# EAGLE design FEZ Cerb40 (EAGLE 5.04)
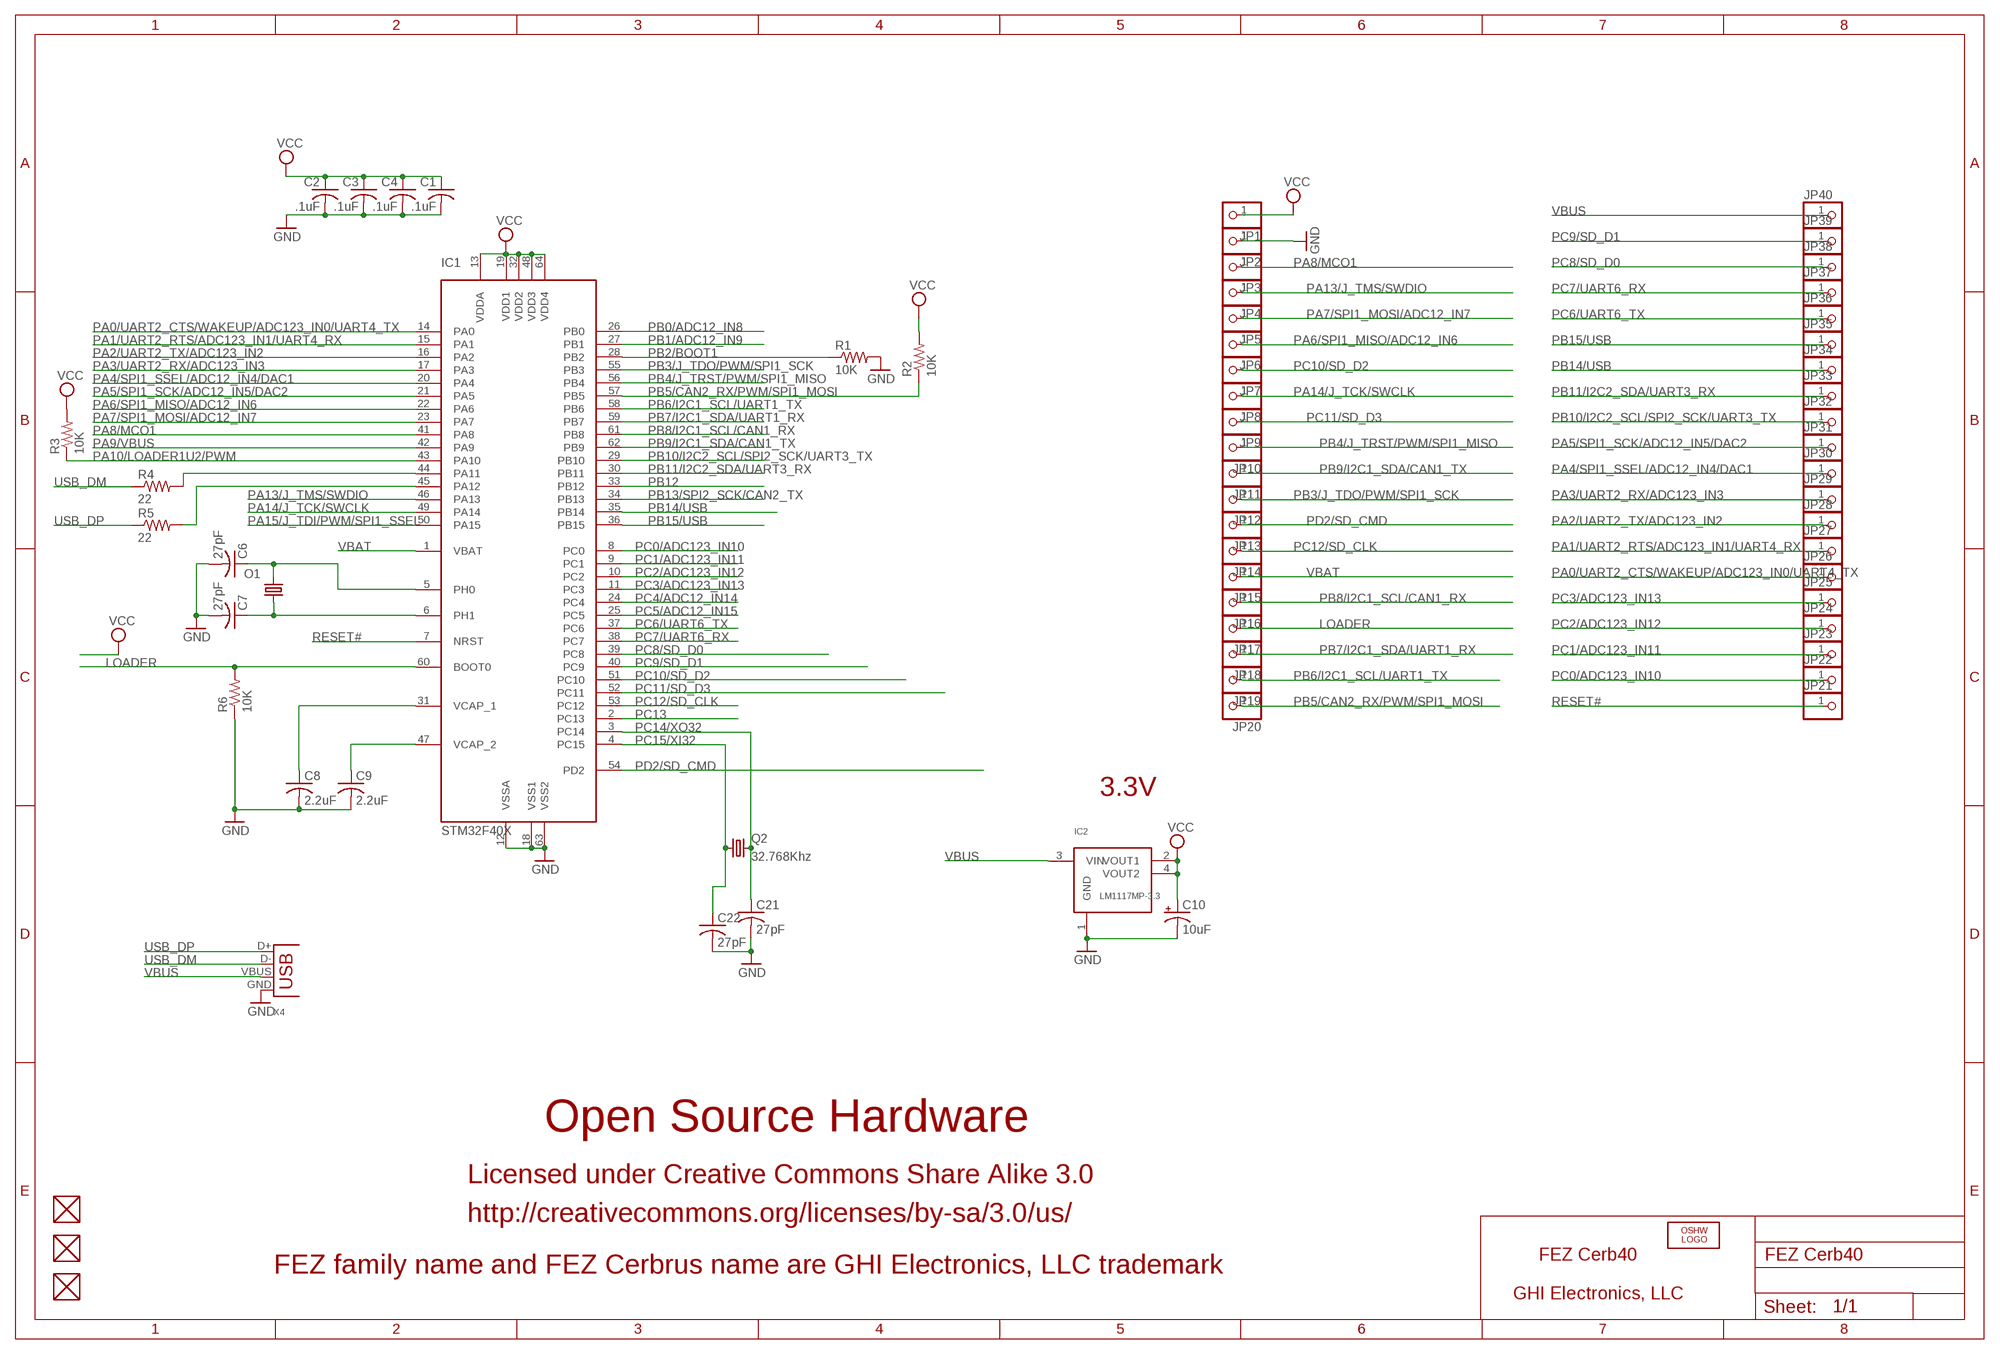
[diagram p0: schematic, sheet 1]

## Parts
C1  .1uF  C-USC0603K  [C0603K]
C2  .1uF  C-USC0603K  [C0603K]
C3  .1uF  C-USC0603K  [C0603K]
C4  .1uF  C-USC0603K  [C0603K]
C6  27pF  C-USC0603K  [C0603K]
C7  27pF  C-USC0603K  [C0603K]
C8  2.2uF  C-USC0805K  [C0805K]
C9  2.2uF  C-USC0805K  [C0805K]
C10  10uF  CPOL-USCT3528  [CT3528]
C21  27pF  C-USC0603K  [C0603K]
C22  27pF  C-USC0603K  [C0603K]
FUD1  FIDUCIAL  [FIDUCIAL_40MIL]
FUD2  FIDUCIAL  [FIDUCIAL_40MIL]
FUD3  FIDUCIAL  [FIDUCIAL_40MIL]
IC1  STM32F40X  [LQFP64]
IC2  LM1117MP-3.3  LM1117  [SOT223]
JP1  PINHD-1X1  [1X01]
JP2  PINHD-1X1  [1X01]
JP3  PINHD-1X1  [1X01]
JP4  PINHD-1X1  [1X01]
JP5  PINHD-1X1  [1X01]
JP6  PINHD-1X1  [1X01]
JP7  PINHD-1X1  [1X01]
JP8  PINHD-1X1  [1X01]
JP9  PINHD-1X1  [1X01]
JP10  PINHD-1X1  [1X01]
JP11  PINHD-1X1  [1X01]
JP12  PINHD-1X1  [1X01]
JP13  PINHD-1X1  [1X01]
JP14  PINHD-1X1  [1X01]
JP15  PINHD-1X1  [1X01]
JP16  PINHD-1X1  [1X01]
JP17  PINHD-1X1  [1X01]
JP18  PINHD-1X1  [1X01]
JP19  PINHD-1X1  [1X01]
JP20  PINHD-1X1  [1X01]
JP21  PINHD-1X1  [1X01]
JP22  PINHD-1X1  [1X01]
JP23  PINHD-1X1  [1X01]
JP24  PINHD-1X1  [1X01]
JP25  PINHD-1X1  [1X01]
JP26  PINHD-1X1  [1X01]
JP27  PINHD-1X1  [1X01]
JP28  PINHD-1X1  [1X01]
JP29  PINHD-1X1  [1X01]
JP30  PINHD-1X1  [1X01]
JP31  PINHD-1X1  [1X01]
JP32  PINHD-1X1  [1X01]
JP33  PINHD-1X1  [1X01]
JP34  PINHD-1X1  [1X01]
JP35  PINHD-1X1  [1X01]
JP36  PINHD-1X1  [1X01]
JP37  PINHD-1X1  [1X01]
JP38  PINHD-1X1  [1X01]
JP39  PINHD-1X1  [1X01]
JP40  PINHD-1X1  [1X01]
LOGO1  LOGO-OSHW-FILLX0200-NT  [OSHW_FILLX200_NOTEXT]
O1  12Mhz  CRYTALSM49  [SM49@1]
Q2  32.768Khz  CRYSTALTC38H  [TC38H]
R1  10K  R-US_R0603  [R0603]
R2  10K  R-US_R0603  [R0603]
R3  10K  R-US_R0603  [R0603]
R4  22  R-US_R0603  [R0603]
R5  22  R-US_R0603  [R0603]
R6  10K  R-US_R0603  [R0603]
X4  DX2R005HN2E700  USB-MB-S  [USB-MB-S]

## Nets
GND [power]: C1.2 C2.2 C3.2 C4.2 C6.2 C7.2 C8.2 C9.2 C10.- C21.2 C22.2 IC1.12(VSSA) IC1.18(VSS1) IC1.63(VSS2) IC2.1(GND) JP2.1 R1.2 R6.1 X4.GND
LOADER: IC1.60(BOOT0) JP17.1 R6.2
N$2: C9.1 IC1.47(VCAP_2)
N$3: C8.1 IC1.31(VCAP_1)
N$5: IC1.44(PA11) R4.2
N$7: IC1.45(PA12) R5.2
PA0/UART2_CTS/WAKEUP/ADC123_IN0/UART4_TX: IC1.14(PA0) JP26.1
PA1/UART2_RTS/ADC123_IN1/UART4_RX: IC1.15(PA1) JP27.1
PA2/UART2_TX/ADC123_IN2: IC1.16(PA2) JP28.1
PA3/UART2_RX/ADC123_IN3: IC1.17(PA3) JP29.1
PA4/SPI1_SSEL/ADC12_IN4/DAC1: IC1.20(PA4) JP30.1
PA5/SPI1_SCK/ADC12_IN5/DAC2: IC1.21(PA5) JP31.1
PA6/SPI1_MISO/ADC12_IN6: IC1.22(PA6) JP6.1
PA7/SPI1_MOSI/ADC12_IN7: IC1.23(PA7) JP5.1
PA8/MCO1: IC1.41(PA8) JP3.1
PA9/VBUS: IC1.42(PA9)
PA10/LOADER1U2/PWM: IC1.43(PA10) R3.1
PA13/J_TMS/SWDIO: IC1.46(PA13) JP4.1
PA14/J_TCK/SWCLK: IC1.49(PA14) JP8.1
PA15/J_TDI/PWM/SPI1_SSEL: IC1.50(PA15)
PB0/ADC12_IN8: IC1.26(PB0)
PB1/ADC12_IN9: IC1.27(PB1)
PB2/BOOT1: IC1.28(PB2) R1.1
PB3/J_TDO/PWM/SPI1_SCK: IC1.55(PB3) JP12.1
PB4/J_TRST/PWM/SPI1_MISO: IC1.56(PB4) JP10.1
PB5/CAN2_RX/PWM/SPI1_MOSI: IC1.57(PB5) JP20.1 R2.1
PB6/I2C1_SCL/UART1_TX: IC1.58(PB6) JP19.1
PB7/I2C1_SDA/UART1_RX: IC1.59(PB7) JP18.1
PB8/I2C1_SCL/CAN1_RX: IC1.61(PB8) JP16.1
PB9/I2C1_SDA/CAN1_TX: IC1.62(PB9) JP11.1
PB10/I2C2_SCL/SPI2_SCK/UART3_TX: IC1.29(PB10) JP32.1
PB11/I2C2_SDA/UART3_RX: IC1.30(PB11) JP33.1
PB12: IC1.33(PB12)
PB13/SPI2_SCK/CAN2_TX: IC1.34(PB13)
PB14/USB: IC1.35(PB14) JP34.1
PB15/USB: IC1.36(PB15) JP35.1
PC0/ADC123_IN10: IC1.8(PC0) JP22.1
PC1/ADC123_IN11: IC1.9(PC1) JP23.1
PC2/ADC123_IN12: IC1.10(PC2) JP24.1
PC3/ADC123_IN13: IC1.11(PC3) JP25.1
PC4/ADC12_IN14: IC1.24(PC4)
PC5/ADC12_IN15: IC1.25(PC5)
PC6/UART6_TX: IC1.37(PC6) JP36.1
PC7/UART6_RX: IC1.38(PC7) JP37.1
PC8/SD_D0: IC1.39(PC8) JP38.1
PC9/SD_D1: IC1.40(PC9) JP39.1
PC10/SD_D2: IC1.51(PC10) JP7.1
PC11/SD_D3: IC1.52(PC11) JP9.1
PC12/SD_CLK: IC1.53(PC12) JP14.1
PC13: IC1.2(PC13)
PC14/XO32: C21.1 IC1.3(PC14) Q2.2
PC15/XI32: C22.1 IC1.4(PC15) Q2.1
PD2/SD_CMD: IC1.54(PD2) JP13.1
RESET#: IC1.7(NRST) JP21.1
USB_DM: R4.1 X4.D-
USB_DP: R5.1 X4.D+
VBAT: IC1.1(VBAT) JP15.1
VBUS: IC2.3(VIN) JP40.1 X4.VBUS
VCC [power]: C1.1 C2.1 C3.1 C4.1 C10.+ IC1.13(VDDA) IC1.19(VDD1) IC1.32(VDD2) IC1.48(VDD3) IC1.64(VDD4) IC2.2(VOUT1) IC2.4(VOUT2) JP1.1 R2.2 R3.2
XTAL3: C6.1 IC1.5(PH0) O1.2
XTAL4: C7.1 IC1.6(PH1) O1.1
Unconnected: FUD1.P$1 FUD2.P$1 FUD3.P$1

## Notes on the sheet
- 3.3V
- Open Source Hardware
- Licensed under Creative Commons Share Alike 3.0
- http://creativecommons.org/licenses/by-sa/3.0/us/
- FEZ Cerb40
- FEZ family name and FEZ Cerbrus name are GHI Electronics, LLC trademark
- GHI Electronics, LLC

## Library data of the parts
C1-C4 C6-C9 C21 C22 = rcl:C-US: CAPACITOR, American symbol
C10 = rcl:CPOL-US: POLARIZED CAPACITOR, American symbol
FUD1-FUD3 = GHI:FIDUCIAL
IC1 = GHI:STM32F40X
IC2 = GHI:LM1117
JP1-JP40 = pinhead:PINHD-1X1: PIN HEADER
LOGO1 = Logo:LOGO-OSHW-FILL
O1 = crystal:CRYTAL: CRYSTAL
Q2 = crystal:CRYSTAL: CRYSTAL
R1-R6 = rcl:R-US_: RESISTOR, American symbol
X4 = con-usb-3:USB: USB Connectors

## Board
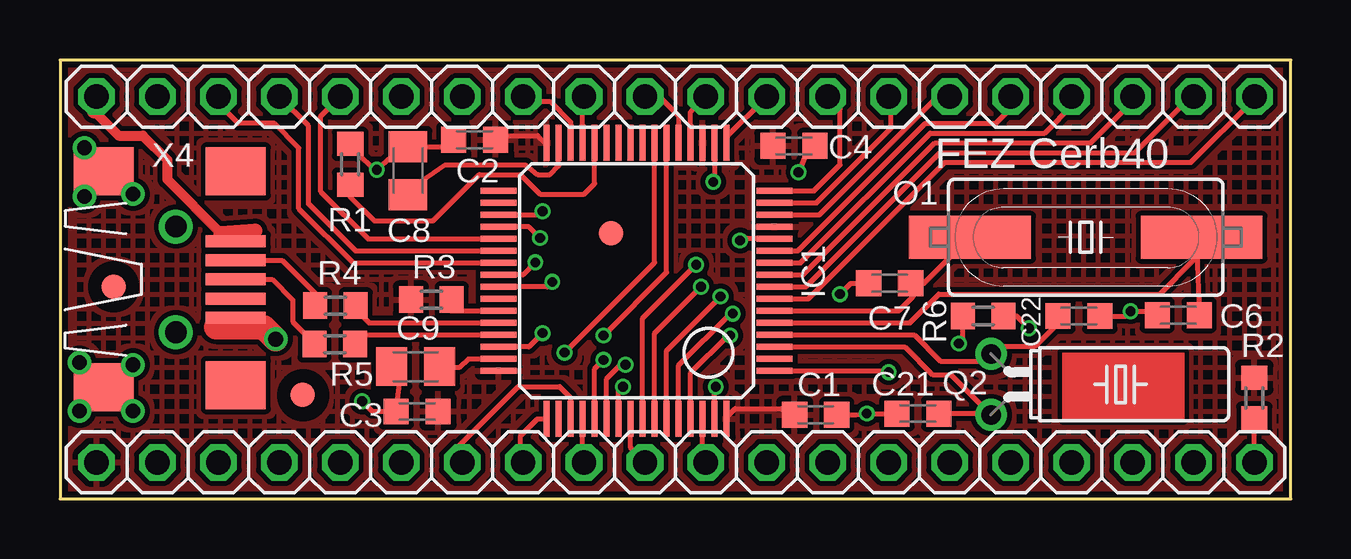
[diagram p1: board, top side]
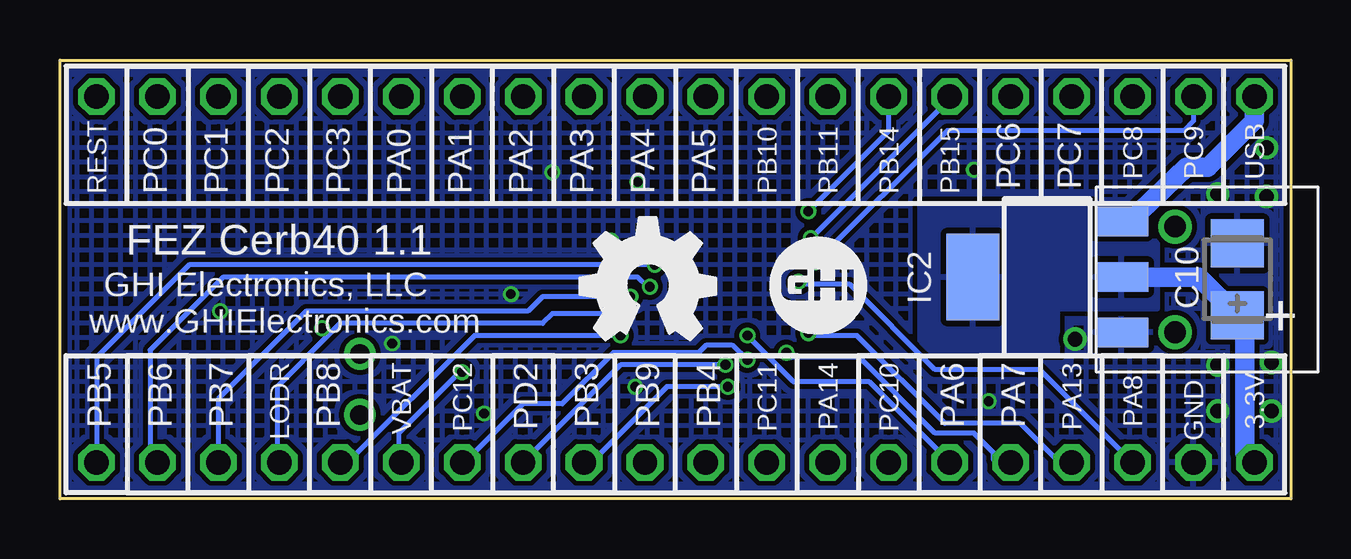
[diagram p2: board, bottom side, seen from below]

Size 51.31 x 18.29 mm. Coordinates in mm from the lower left corner, seen from the top.
Outline: 0,0 51.31,0 51.31,18.29 0,18.29 0,0
Copper layers (1+16): Top 0.035mm / dielectric 1.5mm / Bottom 0.035mm
Design rules "default *": minimum track width 6mil, minimum drill 10mil, track to track 8mil, track to pad 8mil, pad to pad 8mil, via to via 8mil, smd to smd 8mil, copper to edge 10mil, drill to drill 8mil, minimum pad ring 10mil, minimum via ring 5mil, stop-mask expansion 4mil, vias tented up to drill 50mil, thermal gap 10mil
tRestrict: area 9.3,3.4 to 11,5.2; area 1.4,8 to 3.1,9.7

### Footprints (pad centres in the part's own frame; a part is rotated, then mirrored left to right if it is on the bottom)
C0603K = smd 1.05 x 1.08: 1 -0.875,0; 2 0.875,0
C0805K = smd 1.3 x 1.6: 1 -1,0; 2 1,0
CT3528 = smd 2 x 2.2: + -1.5,0; - 1.5,0
FIDUCIAL_40MIL = smd 1.016 x 1.016: P$1 0,0
LQFP64 = smd 0.25 x 1.5: 1 -3.75,-5.75; 2 -3.25,-5.75; 3 -2.75,-5.75; 4 -2.25,-5.75; 5 -1.75,-5.75; 6 -1.25,-5.75; 7 -0.75,-5.75; 8 -0.25,-5.75; 9 0.25,-5.75; 10 0.75,-5.75; 11 1.25,-5.75; 12 1.75,-5.75; 13 2.25,-5.75; 14 2.75,-5.75; 15 3.25,-5.75; 16 3.75,-5.75; 33 3.75,5.75; 34 3.25,5.75; 35 2.75,5.75; 36 2.25,5.75; 37 1.75,5.75; 38 1.25,5.75; 39 0.75,5.75; 40 0.25,5.75; 41 -0.25,5.75; 42 -0.75,5.75; 43 -1.25,5.75; 44 -1.75,5.75; 45 -2.25,5.75; 46 -2.75,5.75; 47 -3.25,5.75; 48 -3.75,5.75 | smd 1.5 x 0.25: 17 5.75,-3.75; 18 5.75,-3.25; 19 5.75,-2.75; 20 5.75,-2.25; 21 5.75,-1.75; 22 5.75,-1.25; 23 5.75,-0.75; 24 5.75,-0.25; 25 5.75,0.25; 26 5.75,0.75; 27 5.75,1.25; 28 5.75,1.75; 29 5.75,2.25; 30 5.75,2.75; 31 5.75,3.25; 32 5.75,3.75; 49 -5.75,3.75; 50 -5.75,3.25; 51 -5.75,2.75; 52 -5.75,2.25; 53 -5.75,1.75; 54 -5.75,1.25; 55 -5.75,0.75; 56 -5.75,0.25; 57 -5.75,-0.25; 58 -5.75,-0.75; 59 -5.75,-1.25; 60 -5.75,-1.75; 61 -5.75,-2.25; 62 -5.75,-2.75; 63 -5.75,-3.25; 64 -5.75,-3.75
SOT223 = smd 1.219 x 2.235: 1 -2.311,-3.099; 2 0,-3.099; 3 2.311,-3.099 | smd 3.6 x 2.2: 4 0,3.099
1X01 = drill 1.016 octagon: 1 0,0
SM49@1 = smd 5.08 x 1.778: 1 -4.826,0; 2 4.826,0
TC38H = drill 0.813 round: 1 -1.27,0; 2 1.27,0
R0603 = smd 1 x 1.1: 1 -0.85,0; 2 0.85,0
USB-MB-S = smd 2.5 x 0.5: D+ 2.5,0; D- 2.5,0.8; GND 2.5,-1.6; ID 2.5,-0.8; VBUS 2.5,1.6 | smd 2.5 x 2: P$1 -3,-4.5; P$2 -3,4.5; P$3 2.5,-4.4; P$4 2.5,4.5 | drill 0.9 round: P$5 0,2.2; P$6 0,-2.2

### Placement (x,y rotation side)
C1  31.5,3.51 0 top
C2  17.29,14.96 180 top
C3  14.88,3.64 180 top
C4  30.6,14.71 0 top
C6  46.61,7.66 180 top
C7  34.59,8.98 180 top
C8  14.51,13.68 90 top
C9  14.82,5.51 180 top
C10  2.24,9.14 90 bottom
C21  35.76,3.56 180 top
C22  42.47,7.62 0 top
FUD1  2.24,8.84 0 top
FUD2  22.96,11.07 0 top
FUD3  10.11,4.34 0 top
IC1  24.03,9.09 90 top
IC2  10.16,9.25 90 bottom
JP1  1.52,1.52 0 top
JP2  4.06,1.52 90 top
JP3  6.6,1.52 90 top
JP4  9.14,1.52 90 top
JP5  11.68,1.52 90 top
JP6  14.22,1.52 90 top
JP7  16.76,1.52 90 top
JP8  19.3,1.52 90 top
JP9  21.84,1.52 90 top
JP10  24.38,1.52 90 top
JP11  26.92,1.52 90 top
JP12  29.46,1.52 90 top
JP13  32,1.52 90 top
JP14  34.54,1.52 90 top
JP15  37.08,1.52 90 top
JP16  39.62,1.52 90 top
JP17  42.16,1.52 90 top
JP18  44.7,1.52 90 top
JP19  47.24,1.52 90 top
JP20  49.78,1.52 90 top
JP21  49.78,16.76 0 top
JP22  47.24,16.76 0 top
JP23  44.7,16.76 0 top
JP24  42.16,16.76 0 top
JP25  39.62,16.76 0 top
JP26  37.08,16.76 0 top
JP27  34.54,16.76 0 top
JP28  32,16.76 0 top
JP29  29.46,16.76 0 top
JP30  26.92,16.76 0 top
JP31  24.38,16.76 0 top
JP32  21.84,16.76 0 top
JP33  19.3,16.76 0 top
JP34  16.76,16.76 0 top
JP35  14.22,16.76 0 top
JP36  11.68,16.76 0 top
JP37  9.14,16.76 0 top
JP38  6.6,16.76 0 top
JP39  4.06,16.76 0 top
JP40  1.52,16.76 0 top
LOGO1  29.64,6.63 0 bottom
O1  42.76,10.9 0 top
Q2  38.81,4.78 270 top
R1  12.1,13.94 90 top
R2  49.78,4.21 90 top
R3  15.48,8.31 180 top
R4  11.48,8.05 0 top
R5  11.46,6.45 0 top
R6  38.48,7.62 0 top
X4  4.83,9.14 0 top

### Tracks (layer width: path | path; a pad name or v marks a point on that pad's centre or on a via)
GND  (via drill 0.41, 0.61)
  Top 0.203: X4.GND 6.88,7.54 6.5,7.16 | C2.2 16.33,14.68 C8.2 14.27,14.68 v13.21,13.72 13.11,13.72 12.39,14.43 12.39,14.9 R1.2 | IC1.63 27.28,4.63 v27.33,4.67 | IC1.12 28.41,10.84 v28.35,10.77 | IC1.18 27.28,13.47 v27.23,13.21 | C4.2 31.17,14.5 v30.79,13.61 | C22.2 44.42,7.62 v44.63,7.82 45.57,7.82 C6.2 | C7.2 32.96,8.98 v32.51,8.53 | C1.2 33.17,3.5 v33.63,3.56 C21.2 | C9.2 14.22,5.29 C3.2 13.02,3.65 v12.6,4.06 | R6.1 37.63,6.64 v37.47,6.48
  Top 1.016: 6.5,7.16 8.48,7.16 v8.99,6.66
  other vias: 0.81,5.69 3.05,5.59 3.05,3.66 0.81,3.66 3.05,12.7 1.02,12.6 1.02,14.63
  pour Bottom (rank 2, hatched): 51.61,18.59 51.61,-0.41 -0.3,-0.41 -0.3,18.59
LOADER  (via drill 0.41)
  Top 0.203: v28.04,7.72 27.94,7.72 25.78,5.57 IC1.60 | R6.2 39.88,7.62 v40.39,7.11
  Bottom 0.203: v28.04,7.72 30.79,7.72 31.19,7.32 39.62,7.32 40.11,6.83 | 40.11,6.83 42.27,4.67 42.27,1.93 42.16,1.83 JP17.1 | 40.11,6.83 v40.39,7.11
N$2
  Top 0.203: IC1.47 17.02,5.84 16.66,5.49 15.75,5.49 C9.1
N$3
  Top 0.203: C8.1 14.55,12.88 16.05,13.92 19.41,13.92 19.91,13.51 20.42,13.51 20.78,13.88 IC1.31
N$5
  Top 0.203: IC1.44 12.88,7.34 12.09,8.13 12.39,8.09 R4.2
N$7
  Top 0.203: IC1.45 12.32,6.84 R5.2
PA0/UART2_CTS/WAKEUP/ADC123_IN0/UART4_TX
  Top 0.203: IC1.14 31.65,11.84 36.58,16.76 JP26.1
PA1/UART2_RTS/ADC123_IN1/UART4_RX
  Top 0.203: IC1.15 31.54,12.34 34.65,15.44 34.65,16.87 | 34.65,16.87 34.54,16.97 | 34.65,16.87 JP27.1
PA2/UART2_TX/ADC123_IN2
  Top 0.203: IC1.16 31.43,12.84 32.51,13.92 32.51,16.26 JP28.1
PA3/UART2_RX/ADC123_IN3
  Top 0.203: IC1.17 27.78,15.08 JP29.1
PA4/SPI1_SSEL/ADC12_IN4/DAC1
  Top 0.203: IC1.20 26.28,16.12 JP30.1
PA5/SPI1_SCK/ADC12_IN5/DAC2
  Top 0.203: IC1.21 25.78,15.97 24.99,16.76 JP31.1
PA6/SPI1_MISO/ADC12_IN6  (via drill 0.41)
  Top 0.203: IC1.22 25.28,9.44 v22.66,6.81
  Bottom 0.203: v22.66,6.81 20.73,4.88 17.58,4.88 JP6.1
PA7/SPI1_MOSI/ADC12_IN7  (via drill 0.41)
  Top 0.203: IC1.23 24.78,9.85 v21.03,6.1
  Bottom 0.203: v21.03,6.1 20.83,5.89 17.98,5.89 14.83,2.74 13.21,2.74 12.39,1.93 12.39,1.63 11.79,1.63 JP5.1
PA8/MCO1  (via drill 0.41)
  Top 0.203: IC1.41 20.32,8.84 v20.52,9.04
  Bottom 0.203: v20.52,9.04 20.42,8.94 18.39,8.94 14.83,5.38 10.46,5.38 JP3.1
PA10/LOADER1U2/PWM
  Top 0.203: IC1.43 16.29,7.84 R3.1
PA13/J_TMS/SWDIO  (via drill 0.41)
  Top 0.203: IC1.46 19.55,6.34 v20.12,6.91
  Bottom 0.203: v20.12,6.91 20.02,6.81 18.09,6.81 14.43,3.15 11.28,3.15 9.75,1.63 9.25,1.63 JP4.1
PA14/J_TCK/SWCLK
  Top 0.203: IC1.49 19.9,3.34 19.2,2.64 19.2,1.63 JP8.1
PB2/BOOT1
  Top 0.203: IC1.28 22.28,13.14 21.84,12.7 20.02,12.7 19.2,13.51 17.48,13.51 15.54,11.58 13.11,11.58 12.09,12.6 12.09,13.29 R1.1
PB3/J_TDO/PWM/SPI1_SCK  (via drill 0.41)
  Top 0.203: IC1.55 23.28,4.49 v23.47,4.67
  Bottom 0.203: v23.47,4.67 26.01,4.67 29.26,1.42 29.36,1.42 JP12.1
PB4/J_TRST/PWM/SPI1_MISO
  Top 0.203: IC1.56 23.78,2.12 JP10.1
PB5/CAN2_RX/PWM/SPI1_MOSI  (via drill 0.41)
  Top 0.203: IC1.57 24.28,7.52 v26.52,9.75 | R2.1 JP20.1
  Bottom 0.203: v26.52,9.75 45.92,9.75 49.78,5.89 JP20.1
PB6/I2C1_SCL/UART1_TX  (via drill 0.41)
  Top 0.203: IC1.58 24.78,6.9 v26.72,8.84
  Bottom 0.203: v26.72,8.84 26.82,8.84 27.23,9.25 44.5,9.25 47.55,6.2 47.55,1.83 JP19.1
PB7/I2C1_SDA/UART1_RX  (via drill 0.41)
  Top 0.203: IC1.59 25.28,6.18 v27.53,8.43
  Bottom 0.203: v27.53,8.43 31.19,8.43 31.8,7.82 41.05,7.82 44.7,4.17 44.7,1.73 44.6,1.63 JP18.1
PB8/I2C1_SCL/CAN1_RX  (via drill 0.41)
  Top 0.203: v27.94,6.81 27.84,6.81 26.28,5.25 IC1.61
  Bottom 0.203: v27.94,6.81 34.04,6.81 39.32,1.52 JP16.1
PB9/I2C1_SDA/CAN1_TX
  Top 0.203: IC1.62 26.78,1.87 27.13,1.52 JP11.1
PB10/I2C2_SCL/SPI2_SCK/UART3_TX
  Top 0.203: IC1.29 21.78,16.81 | 21.78,16.81 21.84,16.87 | 21.78,16.81 21.8,16.81 JP32.1
PB11/I2C2_SDA/UART3_RX
  Top 0.203: IC1.30 21.28,15.7 20.42,16.56 19.51,16.56 JP33.1
PB14/USB  (via drill 0.41)
  Top 0.203: IC1.35 19.97,11.84 v20.12,11.99
  Bottom 0.203: v20.12,11.99 16.76,15.34 JP34.1
PB15/USB  (via drill 0.41)
  Top 0.203: IC1.36 19.55,11.34 v20.02,10.87
  Bottom 0.203: v20.02,10.87 14.33,16.56 14.12,16.56 14.33,16.76 JP35.1
PC0/ADC123_IN10
  Top 0.203: IC1.8 31.09,8.84 36.68,14.43 44.81,14.43 47.24,16.87 JP22.1
PC1/ADC123_IN11
  Top 0.203: IC1.9 30.98,9.34 36.47,14.83 42.98,14.83 44.81,16.66 JP23.1
PC2/ADC123_IN12
  Top 0.203: IC1.10 30.87,9.84 36.27,15.24 41.05,15.24 42.27,16.46 42.27,16.66 JP24.1
PC3/ADC123_IN13
  Top 0.203: IC1.11 30.76,10.34 36.07,15.65 39.01,15.65 39.83,16.46 39.83,16.56 JP25.1
PC6/UART6_TX
  Top 0.203: IC1.37 12.84,10.84 10.87,12.8 10.87,15.95 JP36.1
PC7/UART6_RX
  Top 0.203: IC1.38 12.32,10.34 10.36,12.29 10.36,15.54 JP37.1
PC8/SD_D0
  Top 0.203: IC1.39 12.21,9.84 9.96,12.09 9.96,14.63 8.94,15.65 7.42,15.65 6.5,16.56 6.5,16.66 JP38.1
PC9/SD_D1  (via drill 0.41)
  Top 0.203: IC1.40 19.3,9.34 v19.81,9.86
  Bottom 0.203: v19.81,9.86 14.33,15.34 4.47,15.34 4.06,15.75 JP39.1
PC10/SD_D2
  Top 0.203: IC1.51 21.28,4.22 20.83,4.67 19.1,4.67 16.66,2.23 16.66,1.63 JP7.1
PC11/SD_D3
  Top 0.203: 21.78,1.46 IC1.52 | 21.78,1.46 21.74,1.42 | JP9.1 21.78,1.46
PC12/SD_CLK  (via drill 0.41)
  Top 0.203: IC1.53 22.28,5.42 v22.66,5.79
  Bottom 0.203: v22.66,5.79 23.27,6.4 24.38,6.4 24.69,6.1 28.25,6.1 30.38,3.96 32,3.96 34.24,1.73 34.34,1.73 JP14.1
PC14/XO32
  Top 0.203: IC1.3 35.22,6.34 36.37,5.18 37.13,5.18 Q2.2 38.76,3.56 C21.1
PC15/XI32
  Top 0.203: IC1.4 35.6,6.84 36.7,5.74 39.01,5.74 Q2.1 38.81,6.36 40.65,6.36 41.78,7.49 C22.1
PD2/SD_CMD  (via drill 0.41)
  Top 0.203: IC1.54 22.78,5 23.37,5.59 v23.57,5.59
  Bottom 0.203: v23.57,5.59 27.94,5.59 JP13.1
RESET#
  Top 0.203: IC1.7 31.2,8.34 36.88,14.02 47.14,14.02 49.78,16.66 JP21.1
USB_DM
  Top 0.203: X4.D- 9.26,9.94 10.87,8.33 R4.1
USB_DP
  Top 0.203: R5.1 10.77,6.33 9.7,7.39 9.7,8.28 8.84,9.14 X4.D+
VBAT  (via drill 0.41)
  Top 0.203: IC1.1 34.49,5.34 v34.54,5.28
  Bottom 0.203: v34.54,5.28 34.65,5.28 37.19,2.74 37.19,1.52 | 37.19,1.52 37.08,1.42 | 37.19,1.52 JP15.1
VBUS
  Top 0.203: 1.42,16.66 JP40.1
  Top 0.406: X4.VBUS 7.7,10.74 8.13,11.18 | 6.71,11.07 4.47,13.31 4.47,14.12 3.45,15.14 2.44,15.14 1.42,16.15
  Top 0.61: 6.71,11.07 8.13,11.18 | 1.42,16.15 1.42,16.66
  Bottom 0.813: IC2.3 6.73,11.56 4.37,13.82 3.45,13.82 1.52,15.75 JP40.1
VCC
  Top 0.203: IC1.64 27.78,3.4 28.14,3.76 30.06,3.76 C1.1 | IC1.32 20.21,14.84 19.91,15.14 18.34,15.14 C2.1
  Bottom 0.813: IC2.2 3.84,9.25 C10.+ 2.23,7.11 1.93,6.81 1.93,1.93 JP1.1
  pour Top (hatched): -0.41,18.8 51.82,18.8 51.82,-0.41 -0.41,-0.41
  pour Bottom: 15.44,12.29 5.59,12.29 5.59,7.92 9.75,7.92 9.75,6.1 15.44,6.1
XTAL3
  Top 0.203: IC1.5 35.43,7.34 36.63,8.53 45.85,8.53 47.27,9.96 | 47.27,9.96 O1.2 47.48,10.8 47.27,9.96 | 47.27,9.96 47.39,10.33 C6.1
XTAL4
  Top 0.203: IC1.6 34.97,7.84 35.56,8.43 35.56,8.88 C7.1 36.01,8.98 O1.1
(copper drawn outside any net)
  shapes: Top area x1

### Text on the board
tPlace: FEZ Cerb40
bPlace: USB | PC9 | PC8 | PC7 | PC6 | PB15 | PB14 | PB11 | PB10 | PA5 | PA4 | PA3 | PA2 | PA1 | PA0 | PC3 | PC2 | PC1 | PC0 | REST | FEZ Cerb40 1.1 | GHI Electronics, LLC | + | www.GHIElectronics.com | PA13 | PA7 | PA6 | PC10 | PA14 | PC11 | PB4 | PB9 | PB3 | PD2 | PC12 | VBAT | PB8 | LODR | PB7 | PB6 | PB5 | 3.3V | GND | PA8